# Altium schematic sheet PartA.SchDoc
size A4
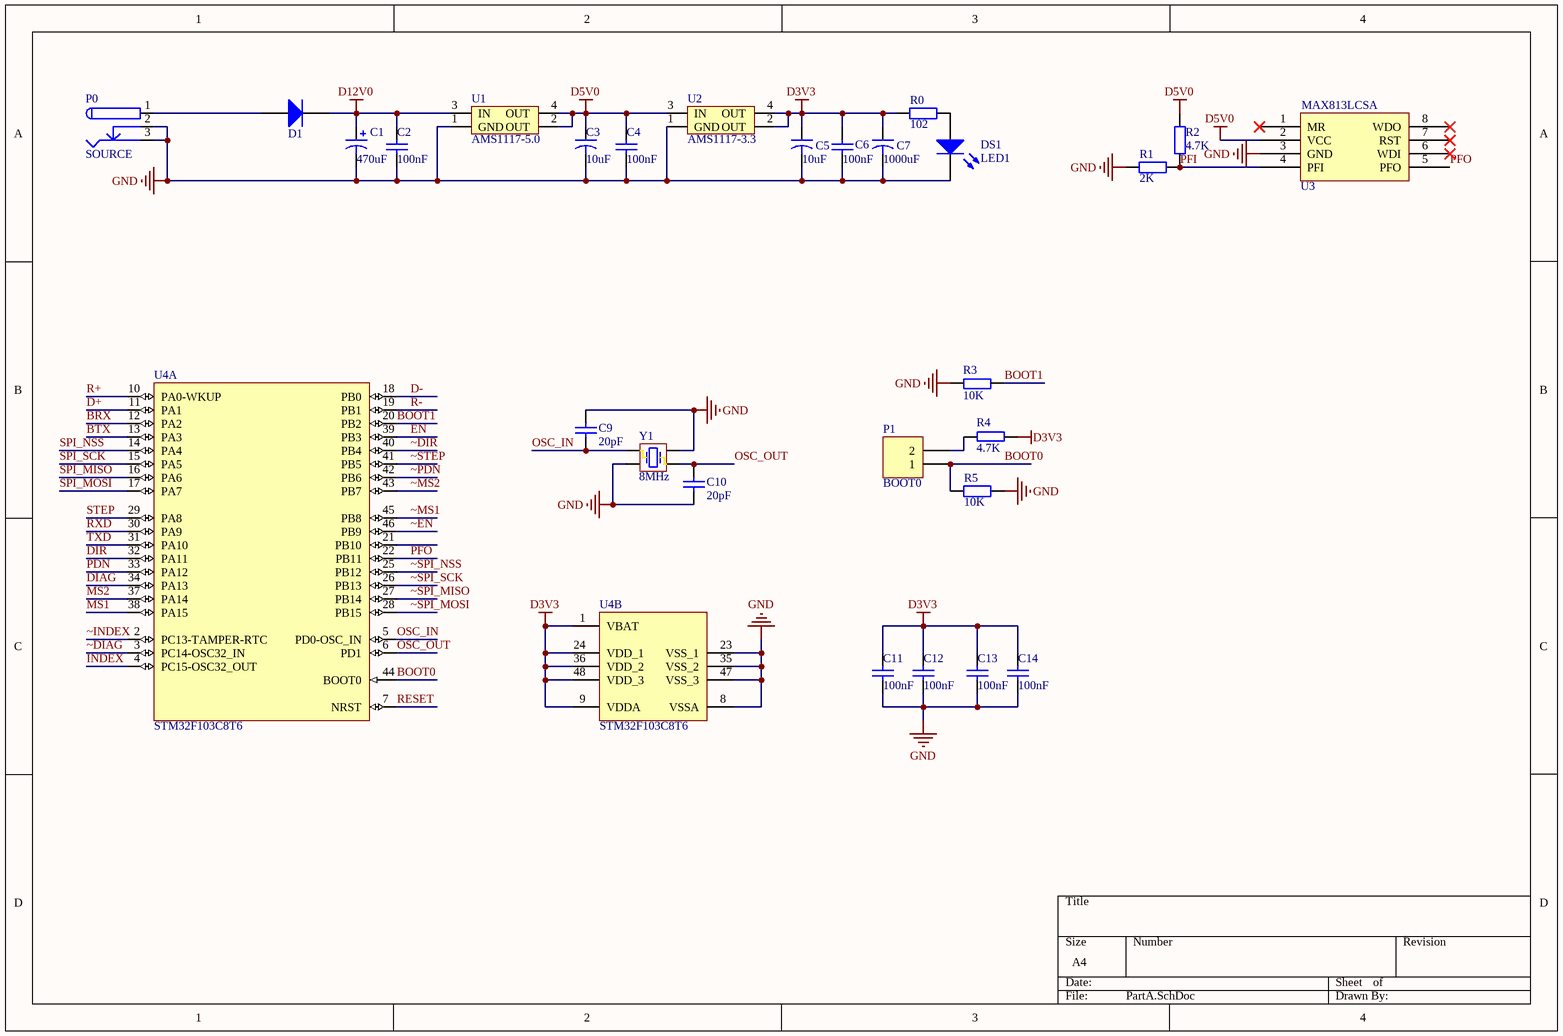
[diagram p0: PartA.SchDoc]

## Parts
C1  470uF  [CAP8]
C2  100nF  [0603C]
C3  10uF  [3216]
C4  100nF  [0603C]
C5  10uF  [3216]
C6  100nF  [0603C]
C7  1000uF  [CAP8]
C9  20pF  [0603C]
C10  20pF  [0603C]
C11  100nF  [0603C]
C12  100nF  [0603C]
C13  100nF  [0603C]
C14  100nF  [0603C]
D1  M7  [DO-214AC]  (value not drawn)
DS1  LED1  [0805D]
P0  SOURCE  [DC_5.5MM]
P1  BOOT0  [HDR1X2]
R0  102  [0603R]
R1  2K  [0603R]
R2  4.7K  [0603R]
R3  10K  [0603R]
R4  4.7K  [0603R]
R5  10K  [0603R]
U1  AMS1117-5.0  [SOT223]
U2  AMS1117-3.3  [SOT223]
U3  MAX813LCSA  [SOP-8]
U4  STM32F103C8T6  [LQFP48_N]  (parts A,B of 2)
Y1  8MHz  [X3225]

## Nets
D3V3: C5.1 C6.2 C7.1 C11.2 C12.2 C13.2 C14.2 R0.2 R4.1 U2.2(OUT) U2.4(OUT) U4.1(VBAT) U4.9(VDDA) U4.24(VDD_1) U4.36(VDD_2) U4.48(VDD_3)
D5V0: C3.1 C4.2 R2.2 U1.2(OUT) U1.4(OUT) U2.3(IN) U3.2(VCC)
D12V0: C1.1 C2.2 D1.2(K) U1.3(IN)
GND: C1.2 C2.1 C3.2 C4.1 C5.2 C6.1 C7.2 C9.2 C10.2 C11.1 C12.1 C13.1 C14.1 DS1.2(K) P0.2 P0.3 R1.1 R3.1 R5.2 U1.1(GND) U2.1(GND) U3.3(GND) U4.8(VSSA) U4.23(VSS_1) U4.35(VSS_2) U4.47(VSS_3) Y1.2(NA) Y1.4(NA)
BOOT0: P1.1 R5.1 U4.44(BOOT0)
BOOT1: R3.2 U4.20(PB2)
BRX: U4.12(PA2)
BTX: U4.13(PA3)
D+: U4.11(PA1)
D-: U4.18(PB0)
DIAG: U4.34(PA13)
DIR: U4.32(PA11)
EN: U4.39(PB3)
INDEX: U4.4(PC15-OSC32_OUT)
MS1: U4.38(PA15)
MS2: U4.37(PA14)
OSC_IN: C9.1 U4.5(PD0-OSC_IN) Y1.1(OSC1)
OSC_OUT: C10.1 U4.6(PD1) Y1.3(OSC2)
PDN: U4.33(PA12)
PFI: R1.2 R2.1 U3.4(PFI)
PFO: U3.5(PFO) U4.22(PB11)
R+: U4.10(PA0-WKUP)
R-: U4.19(PB1)
RESET: U4.7(NRST)
RXD: U4.30(PA9)
SPI_MISO: U4.16(PA6)
SPI_MOSI: U4.17(PA7)
SPI_NSS: U4.14(PA4)
SPI_SCK: U4.15(PA5)
STEP: U4.29(PA8)
TXD: U4.31(PA10)
~DIAG: U4.3(PC14-OSC32_IN)
~DIR: U4.40(PB4)
~EN: U4.46(PB9)
~INDEX: U4.2(PC13-TAMPER-RTC)
~MS1: U4.45(PB8)
~MS2: U4.43(PB7)
~PDN: U4.42(PB6)
~SPI_MISO: U4.27(PB14)
~SPI_MOSI: U4.28(PB15)
~SPI_NSS: U4.25(PB12)
~SPI_SCK: U4.26(PB13)
~STEP: U4.41(PB5)
NetD1_1: D1.1(A) P0.1
NetDS1_1: DS1.1(A) R0.1
NetP1_2: P1.2 R4.2

Not connected (* = marked no-connect by the designer): U3 1(MR)* 6(WDI)* 7(RST)* 8(WDO)*; U4 21(PB10)

## Library data of the parts
C1 = C470UF016S: 470UF      16V      CD10X10D5
C2 C4 C6 C9-C14 = Cap: Capacitor; Published: 8-Jun-2000; LatestRevisionDate: 17-Jul-2002; LatestRevisionNote: Re-released for DXP Platform.; PackageReference: RAD-0.3; Publisher: Altium Limited
  C2 C4 C6 C11-C14: Value: 100nF
  C9 C10: Value: 20pF
C3 C5 C7 = CAP2
  C3 C5: vaule: 10uF
  C7: vaule: 1000uF
D1 = Diode: High Conductance Fast Diode; pin to pad: 1>2 2>1; Published: 8-Jun-2000; LatestRevisionDate: 17-Jul-2002; LatestRevisionNote: Re-released for DXP Platform.; DatasheetDocument: 1997; PackageReference: DO-35; Publisher: Altium Limited; Code_JEDEC: DO-204-AH; ComponentLink1Description: Manufacturer Link; ComponentLink1URL: http://www.fairchildsemi.com/; ComponentLink2Description: Datasheet; ComponentLink2URL: http://www.fairchildsemi.com/ds/1N%2F1N4448.pdf
DS1 = LED2: Typical RED, GREEN, YELLOW, AMBER GaAs LED; Published: 8-Jun-2000; LatestRevisionDate: 17-Jul-2002; LatestRevisionNote: Re-released for DXP Platform.; PackageDocument: Feb-2002; PackageReference: 3.2X1.6X1.1; Publisher: Altium Limited
P1 = MHDR1X2: Header, 2-Pin; LatestRevisionDate: 17-Jul-2002; LatestRevisionNote: Re-released for DXP Platform.; Publisher: Altium Limited
R0-R2 R5 = RES: Resistor; Value: 1K; Published: 8-Jun-2000; Revision: July-2002: Re-released for DXP Platform.; Publisher: Altium Limited
R3 R4 = R
U1 U2 = AMS1117
U3 = MAX813L
U4 = STM32F103C8T6: STM32 ARM-based 32-bit MCU Performance Line with 64 kB Flash, 20 kB Internal RAM, -40 to +85癈 Temperature, 48-Pin LQFP, Tray; DatasheetVersion: rev13.0, Apr-2011; PackageVersion: rev13, Apr-2011; PackageReference: LQFP48; PackageDescription: 48-Pin Low-Profile Quad Flat Pack, 7 x 7 mm Body, 0.5 mm Pitch (LQFP48); ComponentLink1Description: Manufacturer URL; ComponentLink1URL: http://www.st.com/; ComponentLink2Description: STM32F103 Datasheet; ComponentLink2URL: http://www.st.com/internet/com/TECHNICAL_RESOURCES/TECHNICAL_LITERATURE/DATASHEET/CD00161566.pdf; ComponentLink3Description: STM32 Family Web Page; ComponentLink3URL: www.st.com/stm32
Y1 = XTAL_1: Crystal Oscillator; Published: 8-Jun-2000; LatestRevisionDate: 17-Jul-2002; LatestRevisionNote: Re-released for DXP Platform.; PackageReference: R38; Publisher: Altium Limited; Value: 8MHz
P0 = SOURCE: LatestRevisionDate: 17-Jul-2002; LatestRevisionNote: Re-released for DXP Platform.; Publisher: Altium Limited